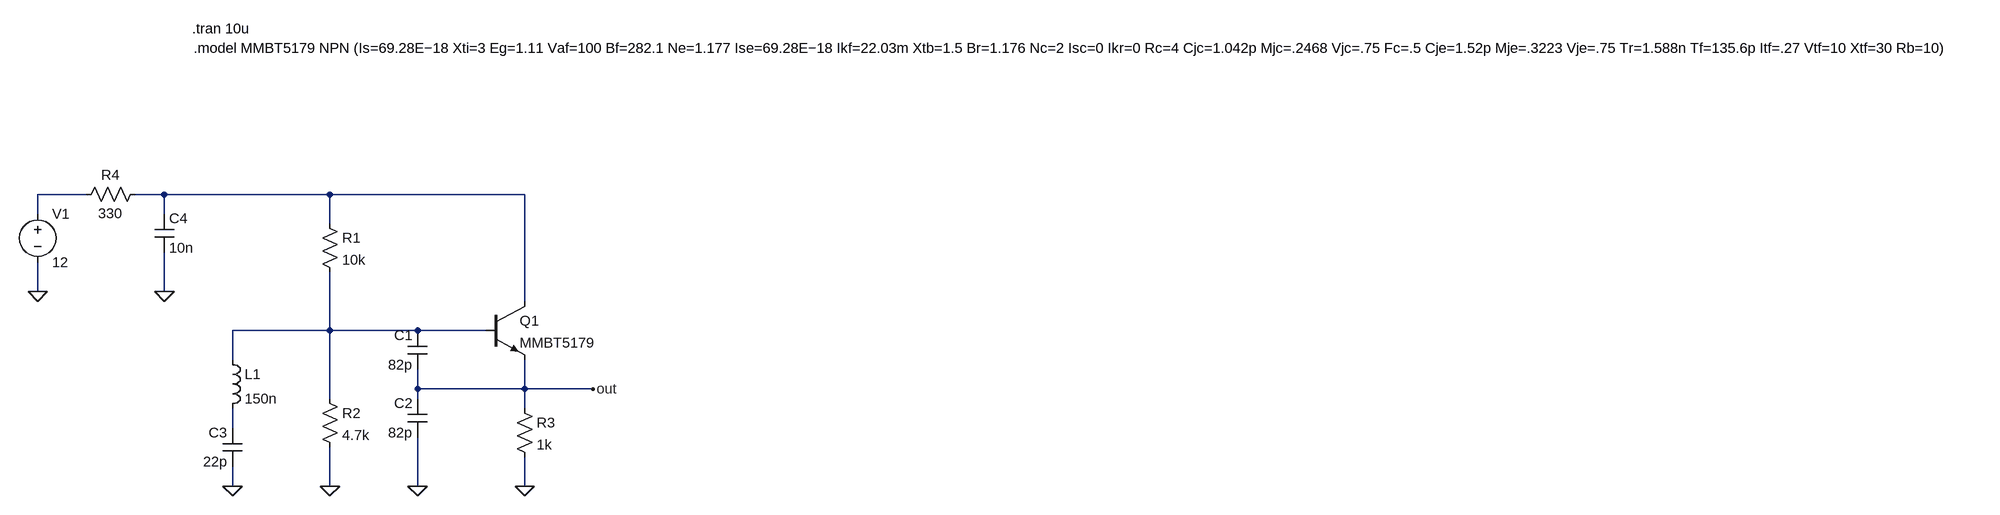
[diagram p0: schematic CC_Clapp_unknown.asc]
CC_Clapp_unknown.asc, the LTspice schematic file:
Version 4
SHEET 1 2692 680
WIRE -736 -64 -816 -64
WIRE -608 -64 -656 -64
WIRE -336 -64 -608 -64
WIRE -16 -64 -336 -64
WIRE -816 -32 -816 -64
WIRE -608 -32 -608 -64
WIRE -336 -16 -336 -64
WIRE -816 96 -816 48
WIRE -608 96 -608 32
WIRE -16 112 -16 -64
WIRE -336 160 -336 64
WIRE -336 160 -496 160
WIRE -192 160 -336 160
WIRE -80 160 -192 160
WIRE -496 208 -496 160
WIRE -192 256 -192 224
WIRE -16 256 -16 208
WIRE -16 256 -192 256
WIRE 96 256 -16 256
WIRE -336 272 -336 160
WIRE -192 272 -192 256
WIRE -16 288 -16 256
WIRE -496 320 -496 288
WIRE -496 416 -496 384
WIRE -336 416 -336 352
WIRE -192 416 -192 336
WIRE -16 416 -16 368
FLAG -816 96 0
FLAG -496 416 0
FLAG -336 416 0
FLAG -192 416 0
FLAG -16 416 0
FLAG 96 256 out
FLAG -608 96 0
DATAFLAG -432 160 ""
DATAFLAG -96 256 ""
DATAFLAG -224 -64 ""
SYMBOL voltage -816 -48 R0
SYMATTR InstName V1
SYMATTR Value 12
SYMBOL res -352 -32 R0
SYMATTR InstName R1
SYMATTR Value 10k
SYMBOL res -352 256 R0
SYMATTR InstName R2
SYMATTR Value 4.7k
SYMBOL res -32 272 R0
SYMATTR InstName R3
SYMATTR Value 1k
SYMBOL cap -176 224 R180
WINDOW 0 24 56 Left 2
WINDOW 3 24 8 Left 2
SYMATTR InstName C1
SYMATTR Value 82p
SYMBOL cap -176 336 R180
WINDOW 0 24 56 Left 2
WINDOW 3 24 8 Left 2
SYMATTR InstName C2
SYMATTR Value 82p
SYMBOL cap -480 384 R180
WINDOW 0 24 56 Left 2
WINDOW 3 24 8 Left 2
SYMATTR InstName C3
SYMATTR Value 22p
SYMBOL ind -512 192 R0
SYMATTR InstName L1
SYMATTR Value 150n
SYMBOL npn -80 112 R0
SYMATTR InstName Q1
SYMATTR Value MMBT5179
SYMBOL res -640 -80 R90
WINDOW 0 0 56 VBottom 2
WINDOW 3 32 56 VTop 2
SYMATTR InstName R4
SYMATTR Value 330
SYMBOL cap -624 -32 R0
SYMATTR InstName C4
SYMATTR Value 10n
TEXT -562 -336 Left 2 !.tran 10u
TEXT -560 -304 Left 2 !.model MMBT5179 NPN (Is=69.28E−18 Xti=3 Eg=1.11 Vaf=100 Bf=282.1 Ne=1.177 Ise=69.28E−18 Ikf=22.03m Xtb=1.5 Br=1.176 Nc=2 Isc=0 Ikr=0 Rc=4 Cjc=1.042p Mjc=.2468 Vjc=.75 Fc=.5 Cje=1.52p Mje=.3223 Vje=.75 Tr=1.588n Tf=135.6p Itf=.27 Vtf=10 Xtf=30 Rb=10)

The netlist it stands for:
* CC_Clapp_unknown.asc
V1 N001 0 12
R1 N002 N003 10k
R2 N003 0 4.7k
R3 out 0 1k
C1 out N003 82p
C2 0 out 82p
C3 0 N004 22p
L1 N003 N004 150n
Q1 N002 N003 out 0 MMBT5179
R4 N002 N001 330
C4 N002 0 10n
.model NPN NPN
.model PNP PNP
.lib standard.bjt
.tran 10u
.model MMBT5179 NPN (Is=69.28E−18 Xti=3 Eg=1.11 Vaf=100 Bf=282.1 Ne=1.177 Ise=69.28E−18 Ikf=22.03m Xtb=1.5 Br=1.176 Nc=2 Isc=0 Ikr=0 Rc=4 Cjc=1.042p Mjc=.2468 Vjc=.75 Fc=.5 Cje=1.52p Mje=.3223 Vje=.75 Tr=1.588n Tf=135.6p Itf=.27 Vtf=10 Xtf=30 Rb=10)
.backanno
.end